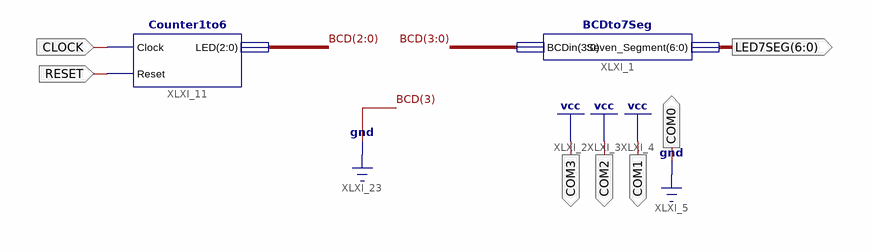
[diagram p0: schematic sheet 1]
// Xilinx ISE schematic Main.sch (spartan6) as structural Verilog: 2 symbols, 7 ports
module Main (
  input  CLOCK,
  input  RESET,
  output [6:0] LED7SEG,
  output COM3,
  output COM2,
  output COM1,
  output COM0
);

  wire [2:0] BCD;

  BCDto7Seg XLXI_1 (.BCDin({1'b0, BCD}), .Seven_Segment(LED7SEG));
  Counter1to6 XLXI_11 (.Clock(CLOCK), .Reset(RESET), .LED(BCD));

  assign COM0 = 1'b0;
  assign COM1 = 1'b1;
  assign COM2 = 1'b1;
  assign COM3 = 1'b1;

  // Notes on the sheet:
  //   LOC on signal LED7SEG(6:0) = P41,P40,P35,P34,P32,P29,P27
  //   LOC on signal COM3 = P30
  //   LOC on signal COM2 = P33
  //   LOC on signal COM1 = P43
  //   LOC on signal COM0 = P44
  //   LOC on signal CLOCK = P45
  //   CLOCK_DEDICATED_ROUTE on signal CLOCK = FALSE
  //   LOC on signal RESET = P46
endmodule
